# Altium schematic sheet M.2 Adapter.SchDoc
size B
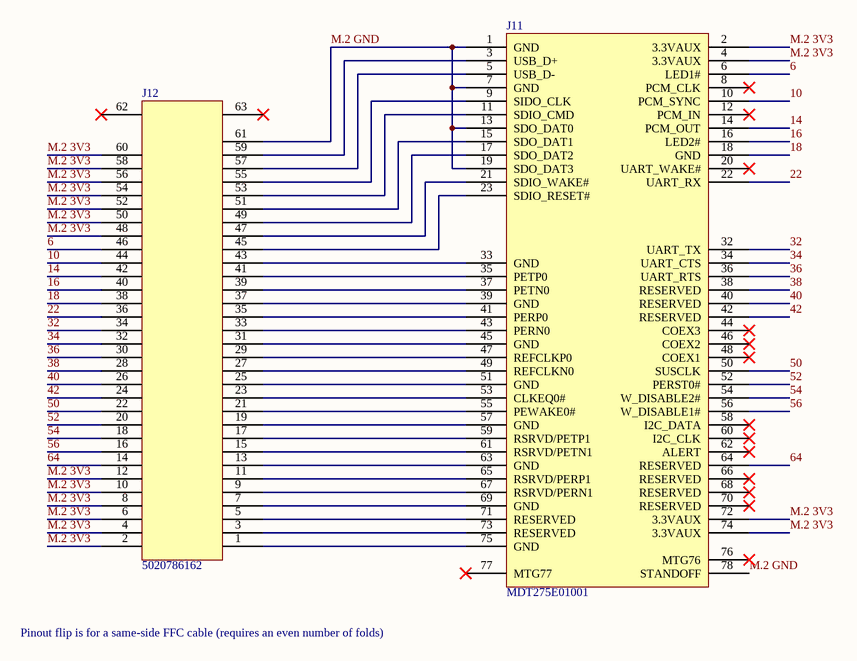
[diagram p0: M.2 Adapter.SchDoc]

## Parts
J11  MDT275E01001  [MDT275E01001]
J12  5020786162  [5020786162]

## Nets
6: J11.6(LED1#) J12.46
10: J11.10(PCM_SYNC) J12.44
14: J11.14(PCM_OUT) J12.42
16: J11.16(LED2#) J12.40
18: J11.18(GND) J12.38
22: J11.22(UART_RX) J12.36
32: J11.32(UART_TX) J12.34
34: J11.34(UART_CTS) J12.32
36: J11.36(UART_RTS) J12.30
38: J11.38(RESERVED) J12.28
40: J11.40(RESERVED) J12.26
42: J11.42(RESERVED) J12.24
50: J11.50(SUSCLK) J12.22
52: J11.52(PERST0#) J12.20
54: J11.54(W_DISABLE2#) J12.18
56: J11.56(W_DISABLE1#) J12.16
64: J11.64(RESERVED) J12.14
M.2 3V3: J11.2(3.3VAUX) J11.4(3.3VAUX) J11.72(3.3VAUX) J11.74(3.3VAUX) J12.2 J12.4 J12.6 J12.8 J12.10 J12.12 J12.48 J12.50 J12.52 J12.54 J12.56 J12.58 J12.60
M.2 GND: J11.1(GND) J11.7(GND) J11.13(SDO_DAT0) J11.19(SDO_DAT3) J11.78(STANDOFF) J12.61
NetJ11_3: J11.3(USB_D+) J12.59
NetJ11_5: J11.5(USB_D-) J12.57
NetJ11_9: J11.9(SIDO_CLK) J12.55
NetJ11_11: J11.11(SDIO_CMD) J12.53
NetJ11_15: J11.15(SDO_DAT1) J12.51
NetJ11_17: J11.17(SDO_DAT2) J12.49
NetJ11_21: J11.21(SDIO_WAKE#) J12.47
NetJ11_23: J11.23(SDIO_RESET#) J12.45
NetJ11_33: J11.33(GND) J12.43
NetJ11_35: J11.35(PETP0) J12.41
NetJ11_37: J11.37(PETN0) J12.39
NetJ11_39: J11.39(GND) J12.37
NetJ11_41: J11.41(PERP0) J12.35
NetJ11_43: J11.43(PERN0) J12.33
NetJ11_45: J11.45(GND) J12.31
NetJ11_47: J11.47(REFCLKP0) J12.29
NetJ11_49: J11.49(REFCLKN0) J12.27
NetJ11_51: J11.51(GND) J12.25
NetJ11_53: J11.53(CLKEQ0#) J12.23
NetJ11_55: J11.55(PEWAKE0#) J12.21
NetJ11_57: J11.57(GND) J12.19
NetJ11_59: J11.59(RSRVD/PETP1) J12.17
NetJ11_61: J11.61(RSRVD/PETN1) J12.15
NetJ11_63: J11.63(GND) J12.13
NetJ11_65: J11.65(RSRVD/PERP1) J12.11
NetJ11_67: J11.67(RSRVD/PERN1) J12.9
NetJ11_69: J11.69(GND) J12.7
NetJ11_71: J11.71(RESERVED) J12.5
NetJ11_73: J11.73(RESERVED) J12.3
NetJ11_75: J11.75(GND) J12.1

Not connected (* = marked no-connect by the designer): J11 8(PCM_CLK)* 12(PCM_IN)* 20(UART_WAKE#)* 44(COEX3)* 46(COEX2)* 48(COEX1)* 58(I2C_DATA)* 60(I2C_CLK)* 62(ALERT)* 66(RESERVED)* 68(RESERVED)* 70(RESERVED)* 76(MTG76)* 77(MTG77)*; J12 62* 63*

## Notes on the sheet
- Pinout flip is for a same-side FFC cable (requires an even number of folds)

## Library data of the parts
J11 = MDT275E01001: CONN M.2 E FMALE 67POS 0.020 GOLD
J12 = 5020786162: Conn FPC Connector SKT 61 POS 0.25mm Solder RA SMD T/R